# EAGLE schematic Clock_Updated_3_Nets (EAGLE 7.1.0)
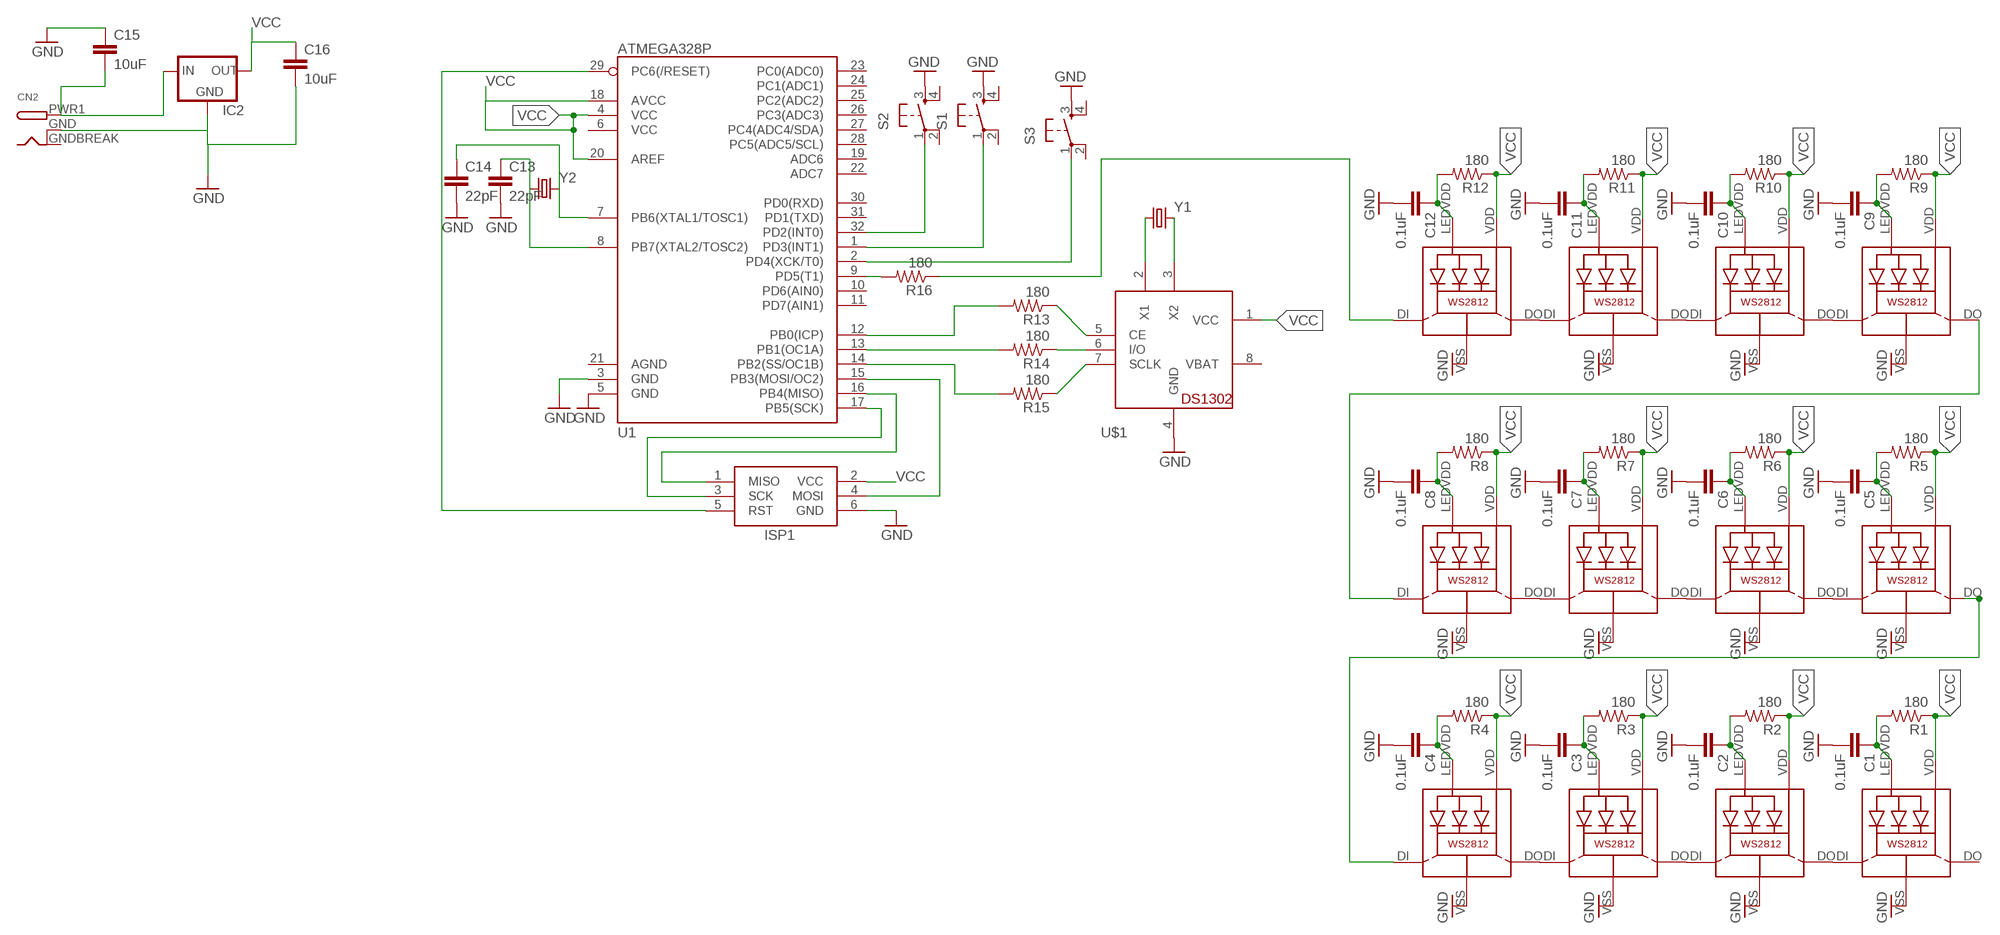
[diagram p0: schematic, sheet 1]

## Parts
C1  0.1uF  0.1UF-25V(+80/-20%)(0603)  [0603-CAP]
C2  0.1uF  0.1UF-25V(+80/-20%)(0603)  [0603-CAP]
C3  0.1uF  0.1UF-25V(+80/-20%)(0603)  [0603-CAP]
C4  0.1uF  0.1UF-25V(+80/-20%)(0603)  [0603-CAP]
C5  0.1uF  0.1UF-25V(+80/-20%)(0603)  [0603-CAP]
C6  0.1uF  0.1UF-25V(+80/-20%)(0603)  [0603-CAP]
C7  0.1uF  0.1UF-25V(+80/-20%)(0603)  [0603-CAP]
C8  0.1uF  0.1UF-25V(+80/-20%)(0603)  [0603-CAP]
C9  0.1uF  0.1UF-25V(+80/-20%)(0603)  [0603-CAP]
C10  0.1uF  0.1UF-25V(+80/-20%)(0603)  [0603-CAP]
C11  0.1uF  0.1UF-25V(+80/-20%)(0603)  [0603-CAP]
C12  0.1uF  0.1UF-25V(+80/-20%)(0603)  [0603-CAP]
C13  22pF  22PF-50V-5%(0603)  [0603-CAP]
C14  22pF  22PF-50V-5%(0603)  [0603-CAP]
C15  10uF  10UF-6.3V-20%(1206)  [1206]
C16  10uF  10UF-6.3V-20%(1206)  [1206]
CN2  DCBARRELSMT  [DCJACK_2MM_SMT]
IC2  V_REG_78XX-TO-220  [TO-220-ALT]
ISP1  AVRISP-6  [AVRISP]
LED1  WS2812  [WS2812]
LED2  WS2812  [WS2812]
LED3  WS2812  [WS2812]
LED4  WS2812  [WS2812]
LED5  WS2812  [WS2812]
LED6  WS2812  [WS2812]
LED7  WS2812  [WS2812]
LED8  WS2812  [WS2812]
LED9  WS2812  [WS2812]
LED10  WS2812  [WS2812]
LED11  WS2812  [WS2812]
LED12  WS2812  [WS2812]
R1  180  180OHM1/10W1%(0603)  [0603-RES]
R2  180  180OHM1/10W1%(0603)  [0603-RES]
R3  180  180OHM1/10W1%(0603)  [0603-RES]
R4  180  180OHM1/10W1%(0603)  [0603-RES]
R5  180  180OHM1/10W1%(0603)  [0603-RES]
R6  180  180OHM1/10W1%(0603)  [0603-RES]
R7  180  180OHM1/10W1%(0603)  [0603-RES]
R8  180  180OHM1/10W1%(0603)  [0603-RES]
R9  180  180OHM1/10W1%(0603)  [0603-RES]
R10  180  180OHM1/10W1%(0603)  [0603-RES]
R11  180  180OHM1/10W1%(0603)  [0603-RES]
R12  180  180OHM1/10W1%(0603)  [0603-RES]
R13  180  180OHM1/10W1%(0603)  [0603-RES]
R14  180  180OHM1/10W1%(0603)  [0603-RES]
R15  180  180OHM1/10W1%(0603)  [0603-RES]
R16  180  180OHM1/10W1%(0603)  [0603-RES]
S1  TAC_SWITCHPTH  [TACTILE-PTH]
S2  TAC_SWITCHPTH  [TACTILE-PTH]
S3  TAC_SWITCHPTH  [TACTILE-PTH]
U1  ATMEGA328P  ATMEGA328_SMT  [TQFP32-08]
U$1  DS1302  [DIL08-ROUND]
Y1  CRYSTALTC38H  [TC38H]
Y2  CRYSTALSMD  [HC49UP]

## Nets
GND: C1.2 C2.2 C3.2 C4.2 C5.2 C6.2 C7.2 C8.2 C9.2 C10.2 C11.2 C12.2 C13.2 C14.2 C15.1 C16.2 CN2.GND(GNDBREAK) IC2.GND ISP1.6(GND) LED1.VSS(GND) LED2.VSS(GND) LED3.VSS(GND) LED4.VSS(GND) LED5.VSS(GND) LED6.VSS(GND) LED7.VSS(GND) LED8.VSS(GND) LED9.VSS(GND) LED10.VSS(GND) LED11.VSS(GND) LED12.VSS(GND) S1.3 S2.3 S3.3 U1.3(GND) U1.5(GND) U$1.4(GND)
N$4: S2.1 U1.32(PD2(INT0))
N$5: U$1.3(X2) Y1.2
N$6: U$1.2(X1) Y1.1
N$7: C1.1 LED1.LEDVDD R1.2
N$8: C2.1 LED2.LEDVDD R2.2
N$9: LED1.DI LED2.DO
N$10: C3.1 LED3.LEDVDD R3.2
N$11: C4.1 LED4.LEDVDD R4.2
N$12: LED3.DI LED4.DO
N$13: C5.1 LED5.LEDVDD R5.2
N$14: C6.1 LED6.LEDVDD R6.2
N$15: LED5.DI LED6.DO
N$16: C7.1 LED7.LEDVDD R7.2
N$17: C8.1 LED8.LEDVDD R8.2
N$18: LED7.DI LED8.DO
N$19: C9.1 LED9.LEDVDD R9.2
N$20: C10.1 LED10.LEDVDD R10.2
N$21: LED9.DI LED10.DO
N$22: C11.1 LED11.LEDVDD R11.2
N$23: C12.1 LED12.LEDVDD R12.2
N$24: LED11.DI LED12.DO
N$25: LED4.DI LED5.DO
N$26: LED8.DI LED9.DO
N$27: R13.1 U$1.5(CE)
N$28: R14.1 U$1.6(I/O)
N$29: R15.1 U$1.7(SCLK)
N$30: S1.1 U1.1(PD3(INT1))
N$31: R14.2 U1.13(PB1(OC1A))
N$32: R13.2 U1.12(PB0(ICP))
N$33: R15.2 U1.14(PB2(SS/OC1B))
N$34: ISP1.3(SCK) U1.17(PB5(SCK))
N$36: ISP1.5(RST) U1.29(PC6(/RESET))
N$37: S3.1 U1.2(PD4(XCK/T0))
N$38: C13.1 U1.8(PB7(XTAL2/TOSC2)) Y2.1
N$39: R16.2 U1.9(PD5(T1))
N$40: LED2.DI LED3.DO
N$41: LED6.DI LED7.DO
N$42: LED10.DI LED11.DO
N$43: LED12.DI R16.1
N$44: C14.1 Y2.2
N$45: C15.2 CN2.PWR1(PWR) IC2.IN
VCC: C16.1 IC2.OUT ISP1.1(MISO) ISP1.2(VCC) ISP1.4(MOSI) LED1.VDD LED2.VDD LED3.VDD LED4.VDD LED5.VDD LED6.VDD LED7.VDD LED8.VDD LED9.VDD LED10.VDD LED11.VDD LED12.VDD R1.1 R2.1 R3.1 R4.1 R5.1 R6.1 R7.1 R8.1 R9.1 R10.1 R11.1 R12.1 U1.4(VCC) U1.15(PB3(MOSI/OC2)) U1.16(PB4(MISO)) U1.20(AREF) U$1.1(VCC)
Unconnected: LED1.DO S1.2 S1.4 S2.2 S2.4 S3.2 S3.4 U1.6(VCC) U1.7(PB6(XTAL1/TOSC1)) U1.10(PD6(AIN0)) U1.11(PD7(AIN1)) U1.18(AVCC) U1.19(ADC6) U1.21(AGND) U1.22(ADC7) U1.23(PC0(ADC0)) U1.24(PC1(ADC1)) U1.25(PC2(ADC2)) U1.26(PC3(ADC3)) U1.27(PC4(ADC4/SDA)) U1.28(PC5(ADC5/SCL)) U1.30(PD0(RXD)) U1.31(PD1(TXD))

## Power pins joined to a net without a drawn wire
GND: CN2.GNDBREAK(GND)
VBAT: U$1.8(VBAT)

## Library data of the parts
C1-C12 = SparkFun-Capacitors:0.1UF-25V(+80/-20%)(0603): CAP-00810 Ceramic Standard decoupling cap; PROD_ID: CAP-00810
C13 C14 = SparkFun-Capacitors:22PF-50V-5%(0603): CAP-07876; PROD_ID: CAP-07876
C15 C16 = SparkFun-Capacitors:10UF-6.3V-20%(1206): CAP-10057 Ceramic; PROD_ID: CAP-10057
CN2 = adafruit:DCBARREL: 2.0mm DC Barrel Jack DCJACK_2MM_PTH - Through Hole Jack (4UConnector: 05537)
IC2 = SparkFun-PowerIC:V_REG_78XX: Voltage Regulator Standard 7805 5V regulator. IGO (Input Ground Output). Spark Fun Electronics SKU : COM-00107
ISP1 = adafruit:AVRISP: AVR ISP HEADER Standard 6 pin header for AVR programming
LED1-LED12 = adafruit:WS2812
R1-R16 = SparkFun-Resistors:180OHM1/10W1%(0603): RES-08788; PROD_ID: RES-08788
S1-S3 = SparkFun-Electromechanical:TAC_SWITCH: Momentary Switch Button commonly used for reset or general input. Spark Fun Electronics SKU : COM-00097 SMT- SWCH-08247
U1 = SparkFun-DigitalIC:ATMEGA328_SMT: 32-Pin Atmega328 part Commonly used on Arduino compatible boards Available in QFP and QFN packages TQFP is IC-09069 QFN is non-stock; PROD_ID: IC-09069
U$1 = adafruit:DS1302: DS1302 - Real time clock with supercap trickle charger
Y1 Y2 = SparkFun-FreqCtrl:CRYSTAL: Various standard crystals. Proven footprints. Spark Fun Electronics SKU : COM-00534